# Altium schematic sheet 04_GBEPHY.SchDoc
size A4; SheetNumber: 5; SheetTotal: 5
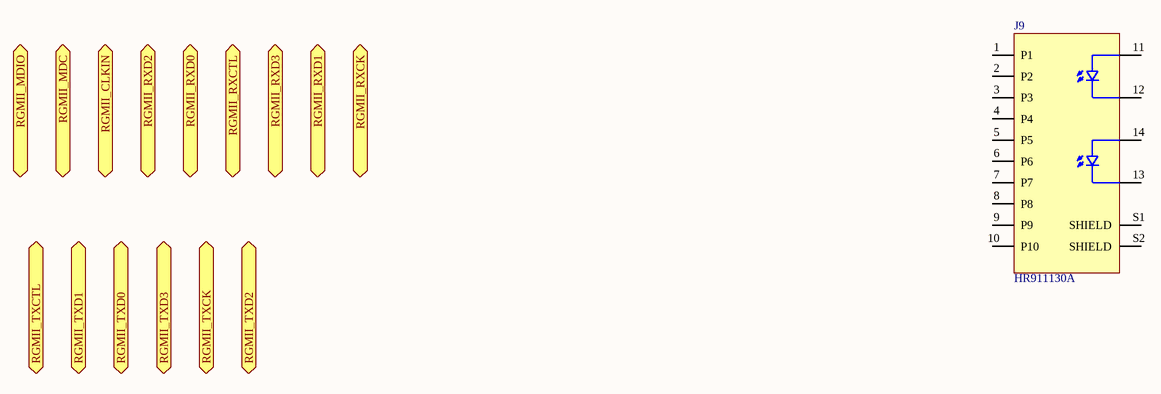
[diagram p0: 04_GBEPHY.SchDoc]

## Parts
J9  HR911130A  [HR911130A]

## Ports
RGMII_CLKIN (bidir), RGMII_MDC (bidir), RGMII_MDIO (bidir), RGMII_RXCK (bidir), RGMII_RXCTL (bidir), RGMII_RXD0 (bidir), RGMII_RXD1 (bidir), RGMII_RXD2 (bidir), RGMII_RXD3 (bidir), RGMII_TXCK (bidir), RGMII_TXCTL (bidir), RGMII_TXD0 (bidir), RGMII_TXD1 (bidir), RGMII_TXD2 (bidir), RGMII_TXD3 (bidir)

## Nets

Not connected (* = marked no-connect by the designer): J9 1(P1) 2(P2) 3(P3) 4(P4) 5(P5) 6(P6) 7(P7) 8(P8) 9(P9) 10(P10) 11 12 13 14 S1(SHIELD) S2(SHIELD)

## Notes on the sheet
- (in symbol HR911130A) GREEN; YELLOW